# EAGLE design BH67172NUX (EAGLE 7.1.0)
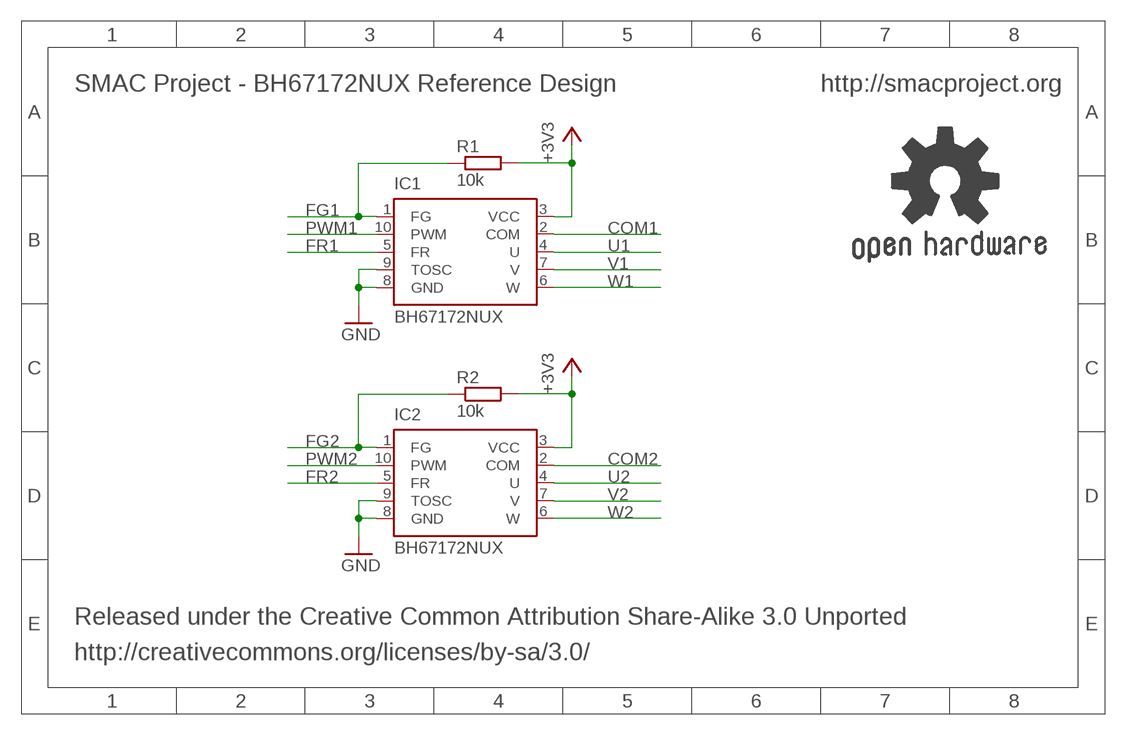
[diagram p0: schematic, sheet 1]

## Parts
GOLD_ORB_SM1  OSHWLOGO_REF_SM  [OSHW2REF]
IC1  BH67172NUX  [VSON010X3030]
IC2  BH67172NUX  [VSON010X3030]
R1  10k  R-EU_R0402  [R0402]
R2  10k  R-EU_R0402  [R0402]

## Nets
+3V3: IC1.3(VCC) IC2.3(VCC) R1.2 R2.2
COM1: IC1.2(COM)
COM2: IC2.2(COM)
FG1: IC1.1(FG) R1.1
FG2: IC2.1(FG) R2.1
FR1: IC1.5(FR)
FR2: IC2.5(FR)
GND: IC1.8(GND) IC1.9(TOSC) IC2.8(GND) IC2.9(TOSC)
PWM1: IC1.10(PWM)
PWM2: IC2.10(PWM)
U1: IC1.4(U)
U2: IC2.4(U)
V1: IC1.7(V)
V2: IC2.7(V)
W1: IC1.6(W)
W2: IC2.6(W)

## Notes on the sheet
- SMAC Project - BH67172NUX Reference Design | http://smacproject.org
- Released under the Creative Common Attribution Share-Alike 3.0 Unported
- http://creativecommons.org/licenses/by-sa/3.0/

## Library data of the parts
GOLD_ORB_SM1 = bfl:OSHWLOGO: These are Open-Source Hardware logos.
IC1 IC2 = rohm:BH67172NUX
R1 R2 = resistor:R-EU_: RESISTOR, European symbol

## Board
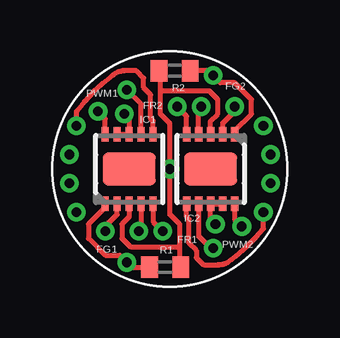
[diagram p1: board, top side]
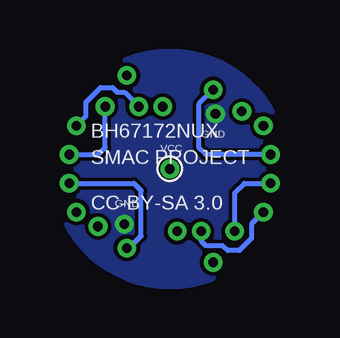
[diagram p2: board, bottom side, seen from below]

No outline drawn. Coordinates in mm, seen from the top.
Copper layers (1*16): Top 0.035mm / dielectric 1.5mm / Bottom 0.035mm
Design rules "2_layer_standard_4pcb": minimum track width 5mil, minimum drill 15mil, track to track 6mil, track to pad 6mil, pad to pad 6mil, via to via 6mil, smd to smd 0mil, copper to edge 6mil, drill to drill 6mil, minimum pad ring 7.5mil, minimum via ring 7.5mil, stop-mask expansion 4mil, vias tented up to drill 15mil, thermal gap 20mil

### Footprints (pad centres in the part's own frame; a part is rotated, then mirrored left to right if it is on the bottom)
VSON010X3030 = smd 0.6 x 0.3: 1 -1.45,1; 2 -1.45,0.5; 3 -1.45,0; 4 -1.45,-0.5; 5 -1.45,-1; 6 1.45,-1; 7 1.45,-0.5; 8 1.45,0; 9 1.45,0.5; 10 1.45,1 | smd 1.36 x 2.2: G 0,0
R0402 = smd 0.7 x 0.9: 1 -0.65,0; 2 0.65,0

### Placement (x,y rotation side)
GOLD_ORB_SM1  12.7,2.4 0 top
IC1  4.6,5.8 90 top
IC2  8,5.8 270 top
R1  6.1,1.7 0 top
R2  6.5,9.9 180 top

### Tracks (layer width: path | path; a pad name or v marks a point on that pad's centre or on a via)
+3V3  (via drill 0.4 pad 0.25)
  Top 0.203: IC1.3 4.6,3.8 4.3,3.5 4.3,2.9 4.65,2.55 6.7,2.55 | 5.9,9.05 7.95,9.05 8.3,8.7 8.3,8.1 8,7.8 IC2.3 | 6.7,2.55 6.7,3.5 6.3,3.9 v6.3,5.8 6.3,7.7 5.9,8.1 5.9,9.05 | 6.7,2.55 6.7,1.75 R1.2 | 5.9,9.05 5.9,9.75 R2.2
COM1  (via drill 0.4 pad 0.25)
  Top 0.203: v3.6,3.2 3.6,3.4 4.1,3.9 IC1.2
  Bottom 0.203: v3.6,3.2 3.6,4.8 3.2,5.2 v2.1,5.2
COM2  (via drill 0.4 pad 0.25)
  Top 0.203: v9,8.4 9,8.2 8.5,7.7 IC2.2
  Bottom 0.203: v10.5,6.4 9.3,6.4 9,6.7 v9,8.4
FG1  (via drill 0.4 pad 0.25)
  Top 0.203: IC1.1 3.6,4.2 2.9,3.5 2.9,2.9 3.6,2.2 4.2,2.2 v4.5,1.9 4.7,1.7 R1.1
FG2  (via drill 0.4 pad 0.25)
  Top 0.203: IC2.1 9,7.4 9.7,8.1 9.7,8.7 9,9.4 8.4,9.4 v8.1,9.7 7.9,9.9 R2.1
FR1  (via drill 0.4 pad 0.25)
  Top 0.203: IC1.5 5.6,3.6 v6,3.2
FR2  (via drill 0.4 pad 0.25)
  Top 0.203: IC2.5 7,8 v6.6,8.4
GND  (via drill 0.4 pad 0.25)
  Top 0.203: IC1.9 IC1.8 4.6,7.9 v4.4,8.1 | v8.2,3.5 8,3.7 IC2.8
  Top 0.254: IC2.9 IC2.8
  pour Bottom: 1.4,5.8 arc-90 6.3,10.7 arc-90 11.2,5.8 arc-90 6.3,0.9 arc-90
PWM1  (via drill 0.4 pad 0.25)
  Top 0.203: IC1.10 3.6,7.9 v3.3,8.2
PWM2  (via drill 0.4 pad 0.25)
  Top 0.203: IC2.10 9,3.7 v9.3,3.4
U1  (via drill 0.4 pad 0.25)
  Top 0.203: IC1.4 5.1,3.3 v5,3.2
  Bottom 0.203: v2.4,4 2.9,3.5 2.9,2.9 3.4,2.4 3.9,2.4 4.1,2.6 4.8,2.6 5,2.8 v5,3.2
U2  (via drill 0.4 pad 0.25)
  Top 0.203: IC2.4 7.5,8.3 v7.6,8.4
  Bottom 0.203: v10.2,7.6 9.8,8 9.8,8.6 9.2,9.2 8.7,9.2 8.5,9 8.2,9 v7.6,8.4
V1  (via drill 0.4 pad 0.25)
  Top 0.203: IC1.7 5.1,8.5 v4.5,9.1
  Bottom 0.203: v2.1,6.4 4.8,6.4 5.1,6.7 5.1,8.5 v4.5,9.1
V2  (via drill 0.4 pad 0.25)
  Top 0.203: IC2.7 7.5,3 8,2.5 v8.1,2.5
  Bottom 0.203: v10.5,5.2 7.8,5.2 7.5,4.9 7.5,3 8,2.5 v8.1,2.5
W1  (via drill 0.4 pad 0.25)
  Top 0.203: v2.4,7.6 2.4,8.2 arc-16 3.9,9.7 arc-37 4.4,9.9 4.9,9.9 5.2,9.6 5.2,9.2 5.5,8.9 5.5,7.9 5.6,7.8 IC1.6
W2  (via drill 0.4 pad 0.25)
  Top 0.203: v10.2,4 10.2,3.3 arc-7 9.2,2.3 arc-9 8.7,1.9 arc-28 8.3,1.8 7.7,1.8 7.4,2.1 7.4,2.4 7.1,2.7 7.1,3.7 7,3.8 IC2.6

### Text on the board
tPlace: PWM1 | FR2 | FG2 | FG1 | FR1 | PWM2
bPlace: GND | BH67172NUX | VCC | SMAC PROJECT | GND | CC-BY-SA 3.0
Reference: http://smacproject.org